# Altium schematic sheet Все.SchDoc: Наименование
size 594 x 420 mm; ApprovedBy: Утвердил; CheckedBy: Проверил; Author: Разработал; CompanyName: Организация; SheetNumber: 1; SheetTotal: 1; PageSetup: Record=PageOptions|CenterHorizontal=True|CenterVertical=True|PrintScale=0.98|XCorrection=1.00|YCorrection=1.00|PrintKind=1|BorderSize=5000000|LeftOffset=0|BottomOffset=0|Orientation=2|PaperLength=1000|PaperWidth=1000|Scale=100|PaperSource=7|PrintQuality=-3|MediaType=1|DitherType=10|PrintScaleMode=1|PaperKind=A2|PaperIndex=66; DecimalNumber: Децимальный номер; HeadOfSector: Нач. сектора; MainDevice: Перв.примен.; Name1: Наименование1; lit_A: О; n_kontr: Н. Контр; t_kontr: Т. Контр; Name2: Наименование2; DocumentName: Sheet1.SCHDOC
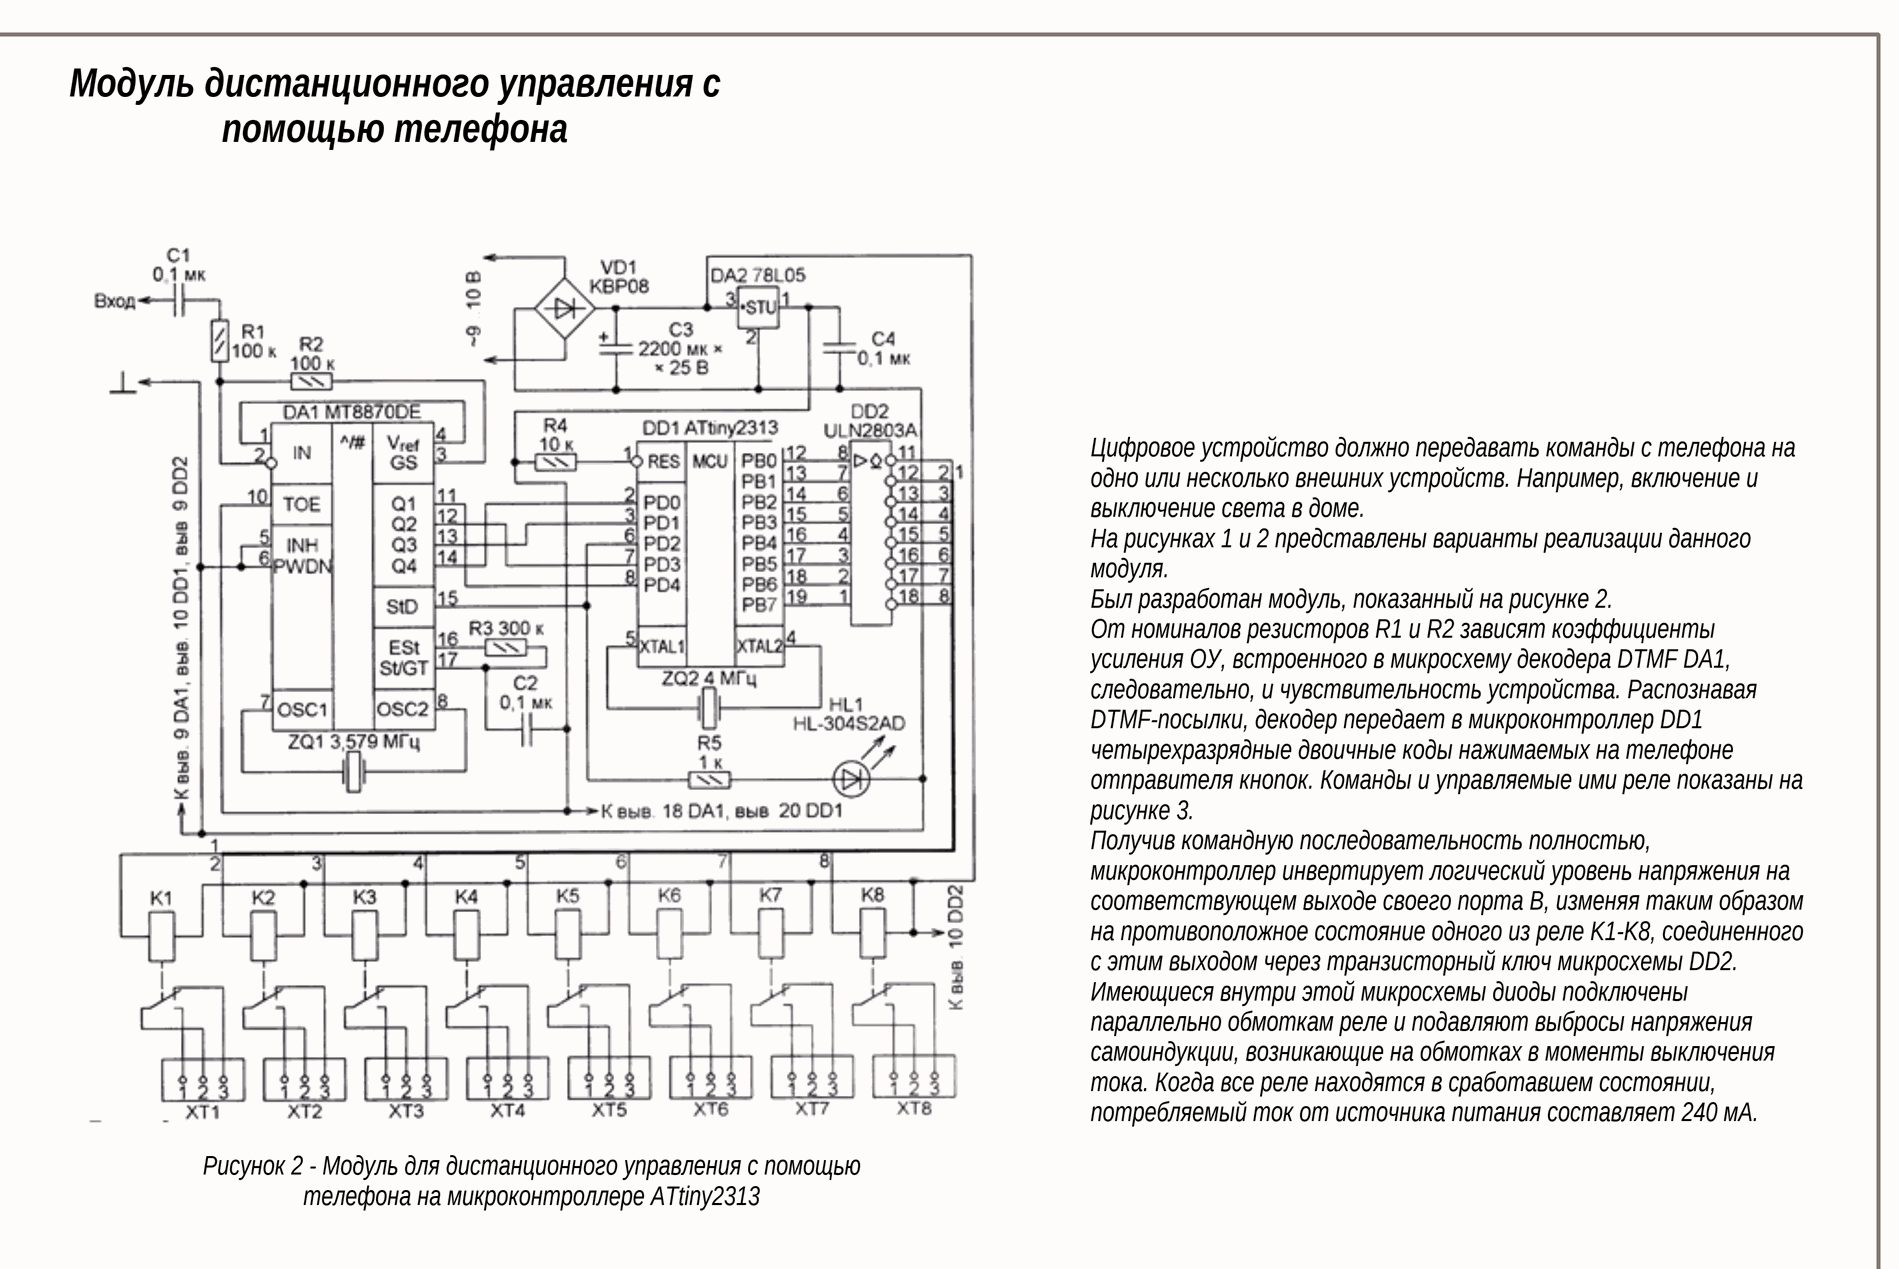
[diagram p0: Все.SchDoc, top right]
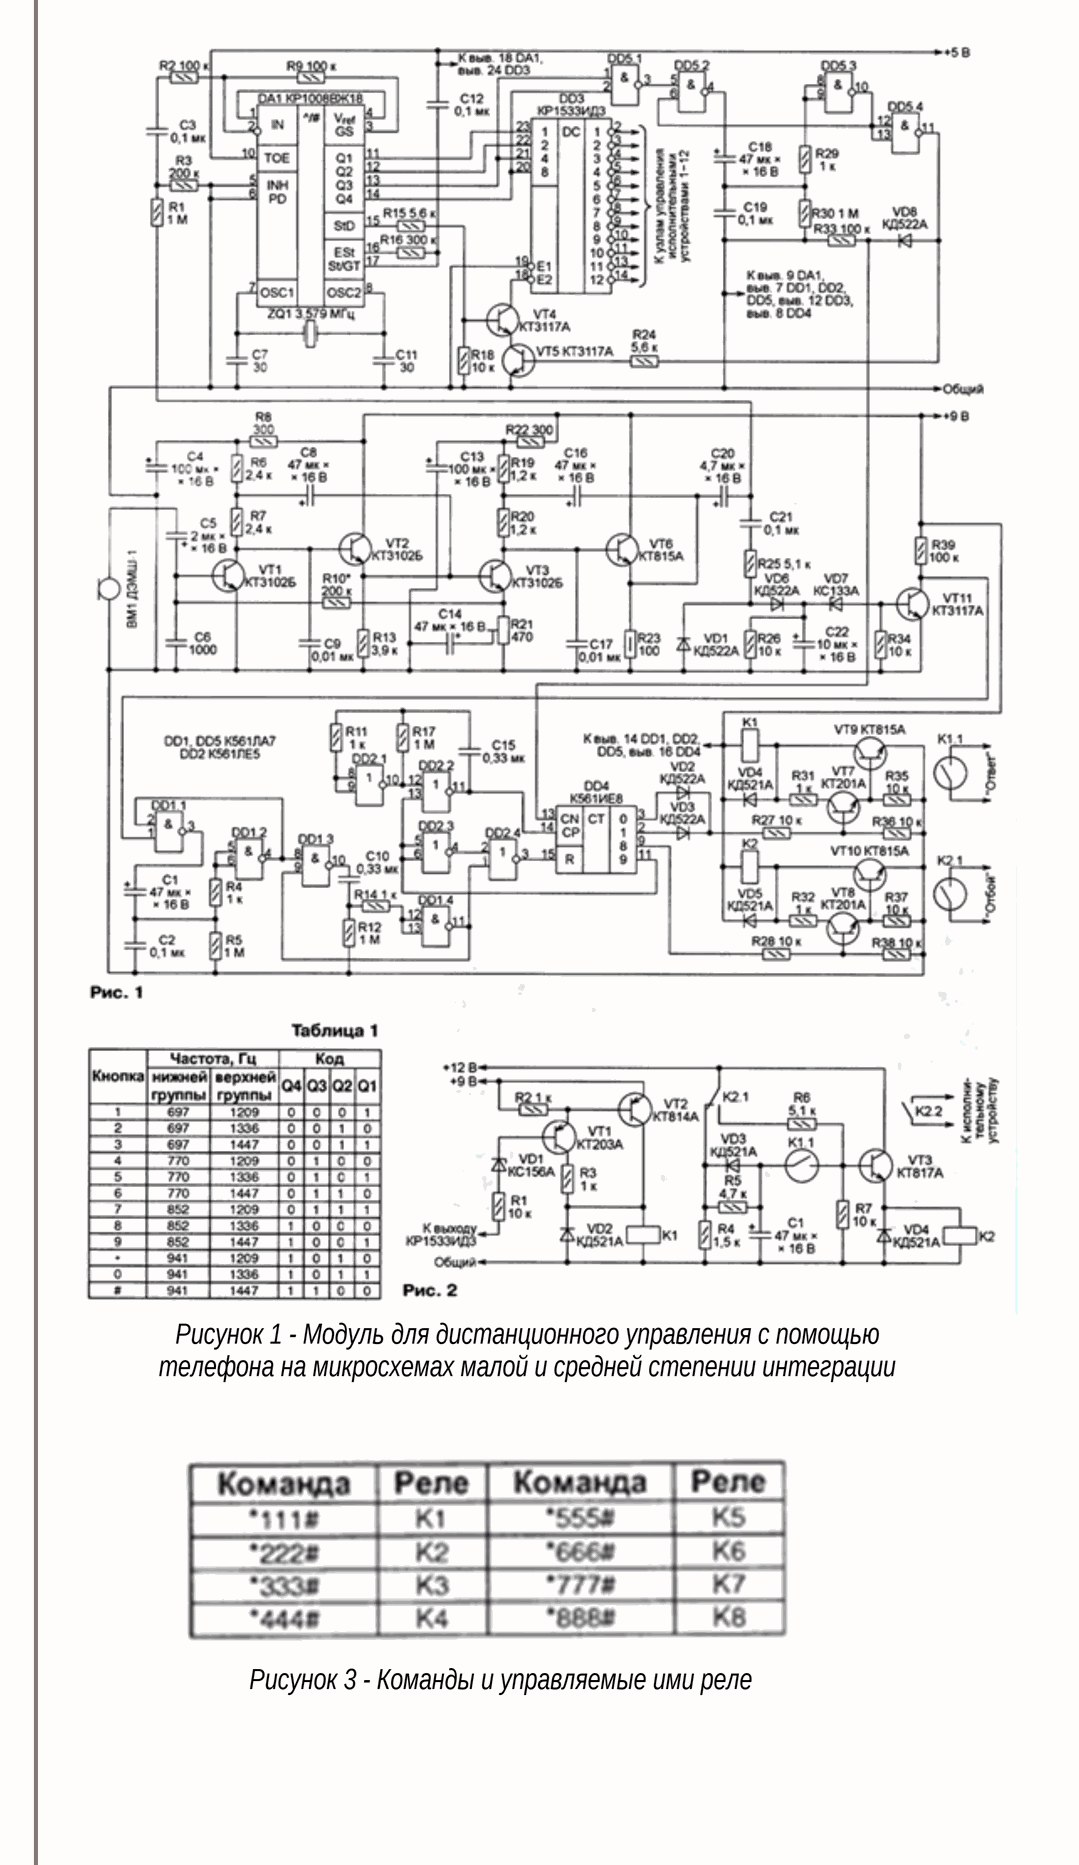
[diagram p1: Все.SchDoc, bottom left]
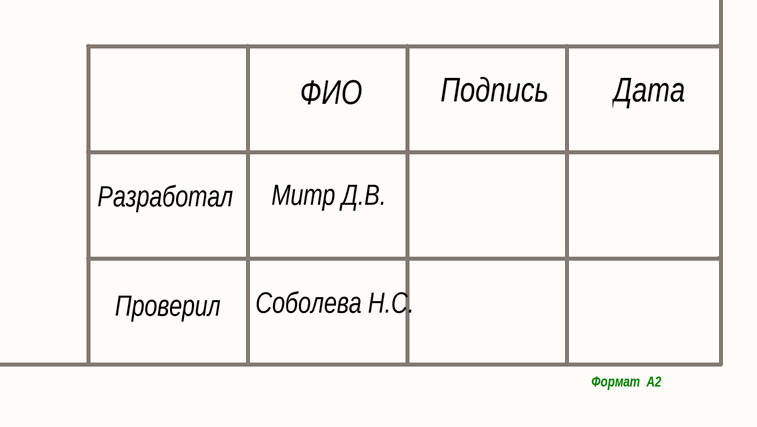
[diagram p2: Все.SchDoc, bottom right]

## Notes on the sheet
- Модуль дистанционного управления с помощью телефона
- Цифровое устройство должно передавать команды с телефона на одно или несколько внешних устройств. Например, включение и выключение света в доме.
  На рисунках 1 и 2 представлены варианты реализации данного модуля.
  Был разработан модуль, показанный на рисунке 2.
  От номиналов резисторов R1 и R2 зависят коэффициенты усиления ОУ, встроенного в микросхему декодера DTMF DA1, следовательно, и чувствительность устройства. Распознавая DTMF-посылки, декодер передает в микроконтроллер DD1 четырехразрядные двоичные коды нажимаемых на телефоне отправителя кнопок. Команды и управляемые ими реле показаны на рисунке 3.
  Получив командную последовательность полностью, микроконтроллер инвертирует логический уровень напряжения на соответствующем выходе своего порта B, изменяя таким образом на противоположное состояние одного из реле K1-K8, соединенного с этим выходом через транзисторный ключ микросхемы DD2. Имеющиеся внутри этой микросхемы диоды подключены параллельно обмоткам реле и подавляют выбросы напряжения самоиндукции, возникающие на обмотках в моменты выключения тока. Когда все реле находятся в сработавшем состоянии, потребляемый ток от источника питания составляет 240 мА.
- Рисунок 2 - Модуль для дистанционного управления с помощью телефона на микроконтроллере ATtiny2313
- Рисунок 1 - Модуль для дистанционного управления с помощью телефона на микросхемах малой и средней степении интеграции
- Рисунок 3 - Команды и управляемые ими реле
- ФИО
- Подпись
- Дата
- Разработал
- Митр Д.В.
- Проверил
- Соболева Н.С.
- Формат  A2